# Altium schematic sheet measurement-ps1-hw.SchDoc
size A2; SheetNumber: 6; SheetTotal: 10
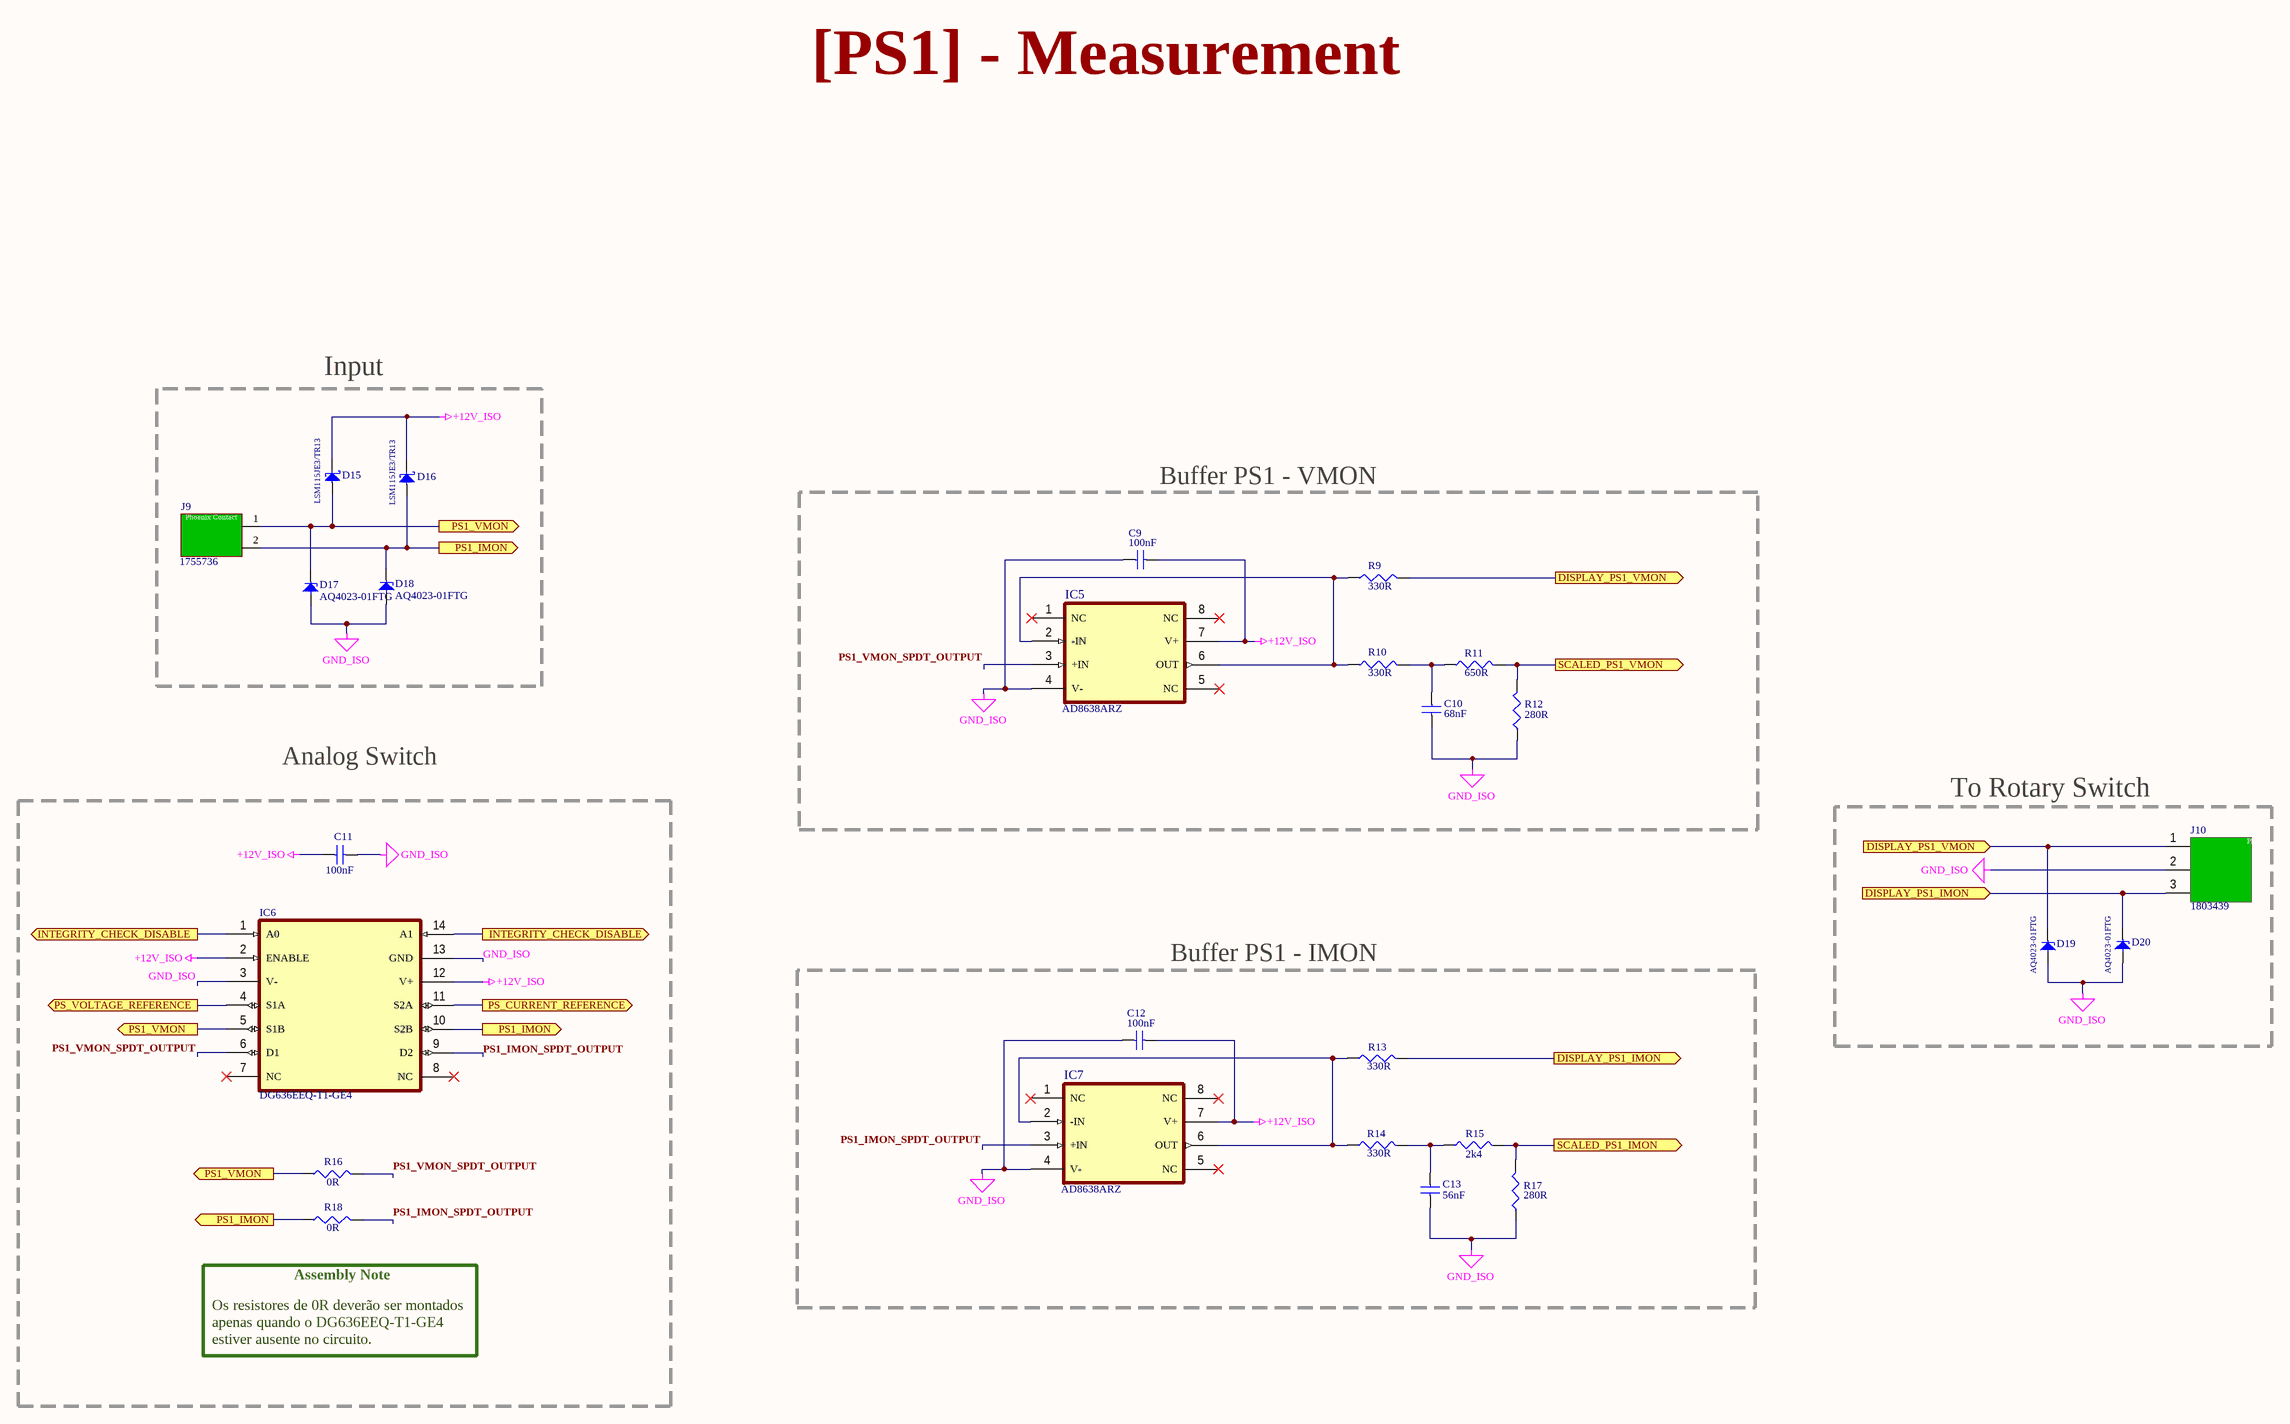
[diagram p0: measurement-ps1-hw.SchDoc]

## Parts
C9  100nF  [C0805]
C10  68nF  [C0805]
C11  100nF  [C0805]
C12  100nF  [C0805]
C13  56nF  [C0805]
D15  LSM115JE3/TR13  [DO-214BA]
D16  LSM115JE3/TR13  [DO-214BA]
D17  AQ4023-01FTG  [SOD-323]
D18  AQ4023-01FTG  [SOD-323]
D19  AQ4023-01FTG  [SOD-323]
D20  AQ4023-01FTG  [SOD-323]
IC5  AD8638ARZ  [SOIC-8]
IC6  DG636EEQ-T1-GE4  [TSSOP-14]
IC7  AD8638ARZ  [SOIC-8]
J9  1755736  [Conector 2 vias]
J10  1803439  [Conector Phoenix 3 vias]
R9  330R  [Resistor 0805]
R10  330R  [Resistor 0805]
R11  650R  [Resistor 0805]
R12  280R  [Resistor 0805]
R13  330R  [Resistor 0805]
R14  330R  [Resistor 0805]
R15  2k4  [Resistor 0805]
R16  0R  [Resistor 0805]
R17  280R  [Resistor 0805]
R18  0R  [Resistor 0805]

## Blocks framed on the sheet
Input: D15-D18 J9
Buffer PS1 - VMON: C9 C10 IC5 R9-R12
Assembly Note: C11 IC6 R16 R18
To Rotary Switch: D19 D20 J10
Buffer PS1 - IMON: C12 C13 IC7 R13-R15 R17

## Ports
DISPLAY_PS1_IMON (in, see measurement-ps1-hw[6C]), DISPLAY_PS1_IMON (out, see measurement-ps1-hw[7B]), DISPLAY_PS1_VMON (in, see measurement-ps1-hw[6B]), DISPLAY_PS1_VMON (out, see measurement-ps1-hw[7B]), INTEGRITY_CHECK_DISABLE (out, see calibration-hw[5B], measurement-output-hw[2B], measurement-output-hw[2D], measurement-output-hw[4B], measurement-output-hw[4D], measurement-ps1-hw[1C], measurement-ps2-hw[1B], measurement-ps2-hw[3B], measurement-ps3-hw[1B], measurement-ps3-hw[3B]), INTEGRITY_CHECK_DISABLE (out, see calibration-hw[5B], measurement-output-hw[2B], measurement-output-hw[2D], measurement-output-hw[4B], measurement-output-hw[4D], measurement-ps1-hw[3C], measurement-ps2-hw[1B], measurement-ps2-hw[3B], measurement-ps3-hw[1B], measurement-ps3-hw[3B]), PS1_IMON (out, see measurement-ps1-hw[2B], measurement-ps1-hw[2C]), PS1_IMON (out, see measurement-ps1-hw[2B], measurement-ps1-hw[3C]), PS1_IMON (out, see measurement-ps1-hw[2C], measurement-ps1-hw[3C]), PS1_VMON (out, see measurement-ps1-hw[1C], measurement-ps1-hw[2B]), PS1_VMON (out, see measurement-ps1-hw[1C], measurement-ps1-hw[2C]), PS1_VMON (out, see measurement-ps1-hw[2B], measurement-ps1-hw[2C]), PS_CURRENT_REFERENCE (out, see calibration-hw[2C], measurement-ps2-hw[3C], measurement-ps3-hw[3C]), PS_VOLTAGE_REFERENCE (out, see calibration-hw[2C], measurement-ps2-hw[1C], measurement-ps3-hw[1C]), SCALED_PS1_IMON (out, see isolated-analog-interface-hw[3B]), SCALED_PS1_VMON (out, see isolated-analog-interface-hw[3A])

## Nets
+12V_ISO: C9.2 C11.1 C12.2 D15.1(C) D16.1(C) IC5.7(V+) IC6.2(ENABLE) IC6.12(V+) IC7.7(V+)
GND_ISO: C9.1 C10.1 C11.2 C12.1 C13.1 D17.2 D18.2 D19.2 D20.2 IC5.4(V-) IC6.3(V-) IC6.13(GND) IC7.4(V-) J10.2 R12.1 R17.1
DISPLAY_PS1_IMON: D20.1 J10.3 R13.2 ; port DISPLAY_PS1_IMON
DISPLAY_PS1_VMON: D19.1 J10.1 R9.2 ; port DISPLAY_PS1_VMON
INTEGRITY_CHECK_DISABLE: IC6.1(A0) IC6.14(A1) ; port INTEGRITY_CHECK_DISABLE
PS1_IMON: D16.2(A) D18.1 IC6.10(S2B) J9.2 R18.1 ; port PS1_IMON
PS1_IMON_SPDT_OUTPUT: IC6.9(D2) IC7.3(+IN) R18.2
PS1_VMON: D15.2(A) D17.1 IC6.5(S1B) J9.1 R16.1 ; port PS1_VMON
PS1_VMON_SPDT_OUTPUT: IC5.3(+IN) IC6.6(D1) R16.2
PS_CURRENT_REFERENCE: IC6.11(S2A) ; port PS_CURRENT_REFERENCE
PS_VOLTAGE_REFERENCE: IC6.4(S1A) ; port PS_VOLTAGE_REFERENCE
SCALED_PS1_IMON: R15.2 R17.2 ; port SCALED_PS1_IMON
SCALED_PS1_VMON: R11.2 R12.2 ; port SCALED_PS1_VMON
NetC10_2: C10.2 R10.2 R11.1
NetC13_2: C13.2 R14.2 R15.1
NetIC5_2: IC5.2(-IN) IC5.6(OUT) R9.1 R10.1
NetIC7_2: IC7.2(-IN) IC7.6(OUT) R13.1 R14.1

Not connected (* = marked no-connect by the designer): IC5 1(NC)* 5(NC)* 8(NC)*; IC6 7(NC)* 8(NC)*; IC7 1(NC)* 5(NC)* 8(NC)*

## Notes on the sheet
- [PS1] - Measurement
- Analog Switch
- Os resistores de 0R deverão ser montados apenas quando o DG636EEQ-T1-GE4 estiver ausente no circuito.
- Title:
- Drawn by:
- Revision:
- Copyright CNPEM 2023.
  This documentation describes Open Hardware and is licensed under the CERN OHL S v2. You may redistribute and modify this documentation under the terms of the CERN OHL S v2. (https://www.ohwr.org/cernohl). This documentation is distributed WITHOUT ANY EXPRESS OR IMPLIED WARRANTY, INCLUDING OF MERCHANTABILITY, SATISFACTORY QUALITY AND FITNESS FOR A PARTICULAR PURPOSE. Please see the CERN OHL S v2 for applicable conditions.
- File:
- Date:
- Project:
- Time:
- Sheet
- of
- ENT - AIS - SEI
  Sistemas Eletrônicos e
  Instrumentação
- (in symbol Conector Phoenix 3 vias) Phoenix Contact
- (in symbol Phoenix 1755736) Phoenix Contact

## Library data of the parts
C9 C11 C12 = Capacitor 100nF
C10 = Capacitor 68nF
C13 = Capacitor 56nF
D15 D16 = LSM115JE3/TR13: DIODE SCHOTTKY 15V, 1A, DO214BA
D17-D20 = AQ4023-01FTG: Unidirectional TVS DIode, 12A, 1.3pF
IC5 IC7 = AD8638ARZ: 16V, Auto-Zero, Rail-to-Rail Output Operational Amplifiers
IC6 = DG636EEQ-T1-GE4: Analog Switch Dual-SPDT, 14 pins; Supplier 1: Newark; Supplier Part Number 1: 56AJ9808
J9 = Phoenix 1755736: Term Block HDR 2POS VERT 5.08MM
J10 = Conector Phoenix 3 vias
R9 R10 R13 R14 = Resistor 330R
R11 = Resistor 650R
R12 R17 = Resistor 280R
R15 = Resistor 2k4
R16 R18 = Resistor 0R - 0805: Size 0805